# EasyEDA Pro project ProPrj_gas alarm_2025-01-07.epro

# Schematic Schematic1
Board Name: Board1; Create Date: 2024-12-28; Page Name: P1; Project Name: gas alarm; Schematic Name: Schematic1; Update Date: 2024-12-31; Company: EasyEDA.com; Page Size: A4; Version: V1.0
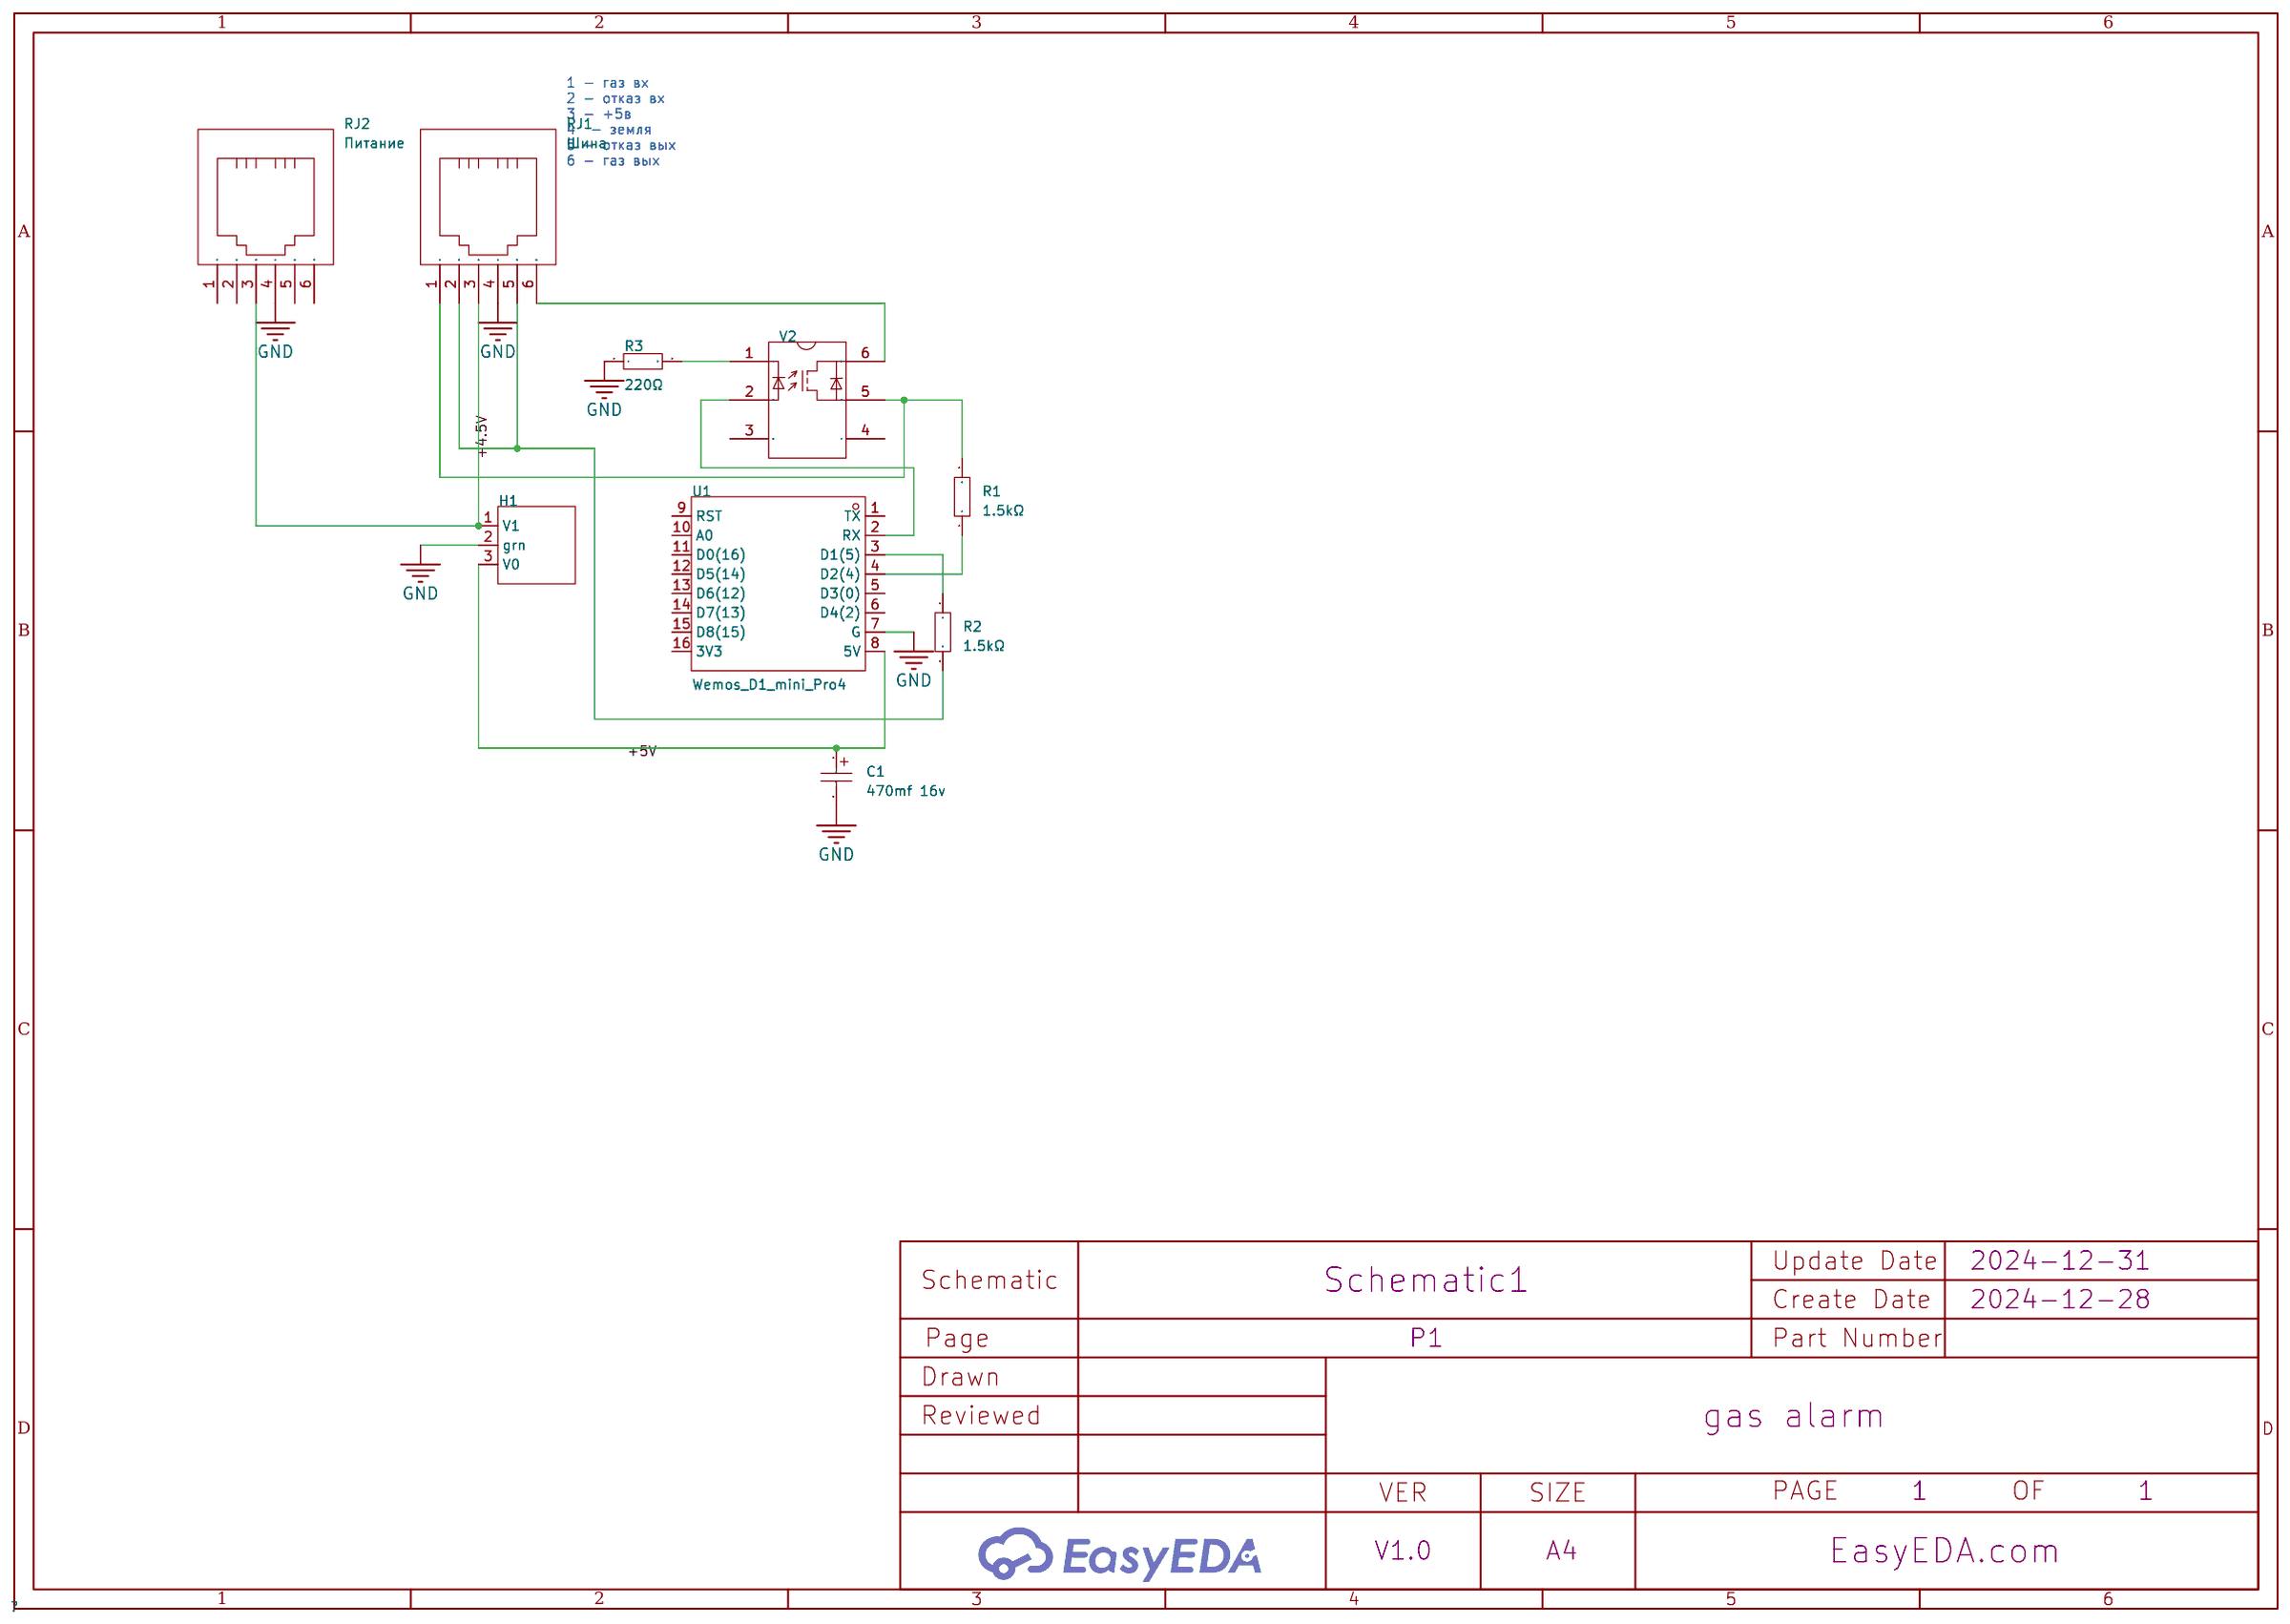
[diagram p0: schematic sheet]

## Parts
C1  470mf 16v  [LAMP-TH_BD5.8-P2.00_2181]
H1  -  [HW-626]
R1  1.5kΩ  [R_AXIAL-0.4]
R2  1.5kΩ  [R_AXIAL-0.4]
R3  220Ω  [R_AXIAL-0.4]
RJ1  Шина  [RJ45-TH_KINGHELM_KH-9801-6P6C]
RJ2  Питание  [RJ45-TH_KINGHELM_KH-9801-6P6C]
U1  Wemos_D1_mini_Pro4  [DIP-16_WEMOS_D1_MINI_PRO4]
V2  -  [DIP6]

## Library data of the parts
C1 = C_Ele_SMD_3x5.4mm: Supplier Footprint: SMD,3x5.4mm
H1 = HW-6261: Supplier Footprint: Through
R1-R3 = Res_AXIAL-1/4W: Supplier Footprint: Through
RJ1 RJ2 = KH-9801-6P6C: Connector Type:- Number of Ports:1 Mounting Style:Right-Angle Shielding:Unshielded LED:不带LED Ratings:- Operating Temperature Range:0℃~+70℃ Operating Temperature Range:0℃~+70℃; LCSC Part Name: 弯插 不带LED; Supplier Part: C2683355; Manufacturer: kinghelm(金航标); Manufacturer Part: RJ-12 (RJ-25) 6P6C; Supplier Footprint: 插件; JLCPCB Part Class: Extended Part; Datasheet: https://atta.szlcsc.com/upload/public/pdf/source/20210106/C2683355_D23B52E5E92918463C1B01F1D9BAADBB.pdf; Supplier: LCSC; Number of Ports: 1; Mounting Style: Right-Angle; Shielding: Unshielded; LED: 不带LED; Operating Temperature Range: 0℃~+70℃
U1 = Wemos_D1_mini_Pro4: Supplier Part: C2837266; Supplier Footprint: DIP-16; JLCPCB Part Class: Extended Part; Supplier: LCSC
V2 = KP293KП

## Nets
+4.5V: H1.1(V1) RJ1.3 RJ2.3
+5V: C1.1 H1.3(V0) U1.8(5V)
GND: C1.2 H1.2(grn) R3.1 RJ1.4 RJ2.4 U1.7(G)
$1N1308: R3.2 V2.1
$1N1397: R2.2 RJ1.2 RJ1.5
$1N1426: RJ1.6 V2.6
$1N2007: R1.2 RJ1.1 V2.5
$1N2050: U1.2(RX) V2.2
$1N3633: R2.1 U1.3(D1(5))
$1N3641: R1.1 U1.4(D2(4))

Not connected (* = marked no-connect by the designer): RJ2 1 2 5 6; U1 1(TX) 5(D3(0)) 6(D4(2)) 9(RST) 10(A0) 11(D0(16)) 12(D5(14)) 13(D6(12)) 14(D7(13)) 15(D8(15)) 16(3V3); V2 3 4

## Notes on the sheet
- 1 - газ вх
  2 - отказ вх
  3 - +5в
  4  - земля
  5 - отказ вых
  6 - газ вых

# Board PCB1
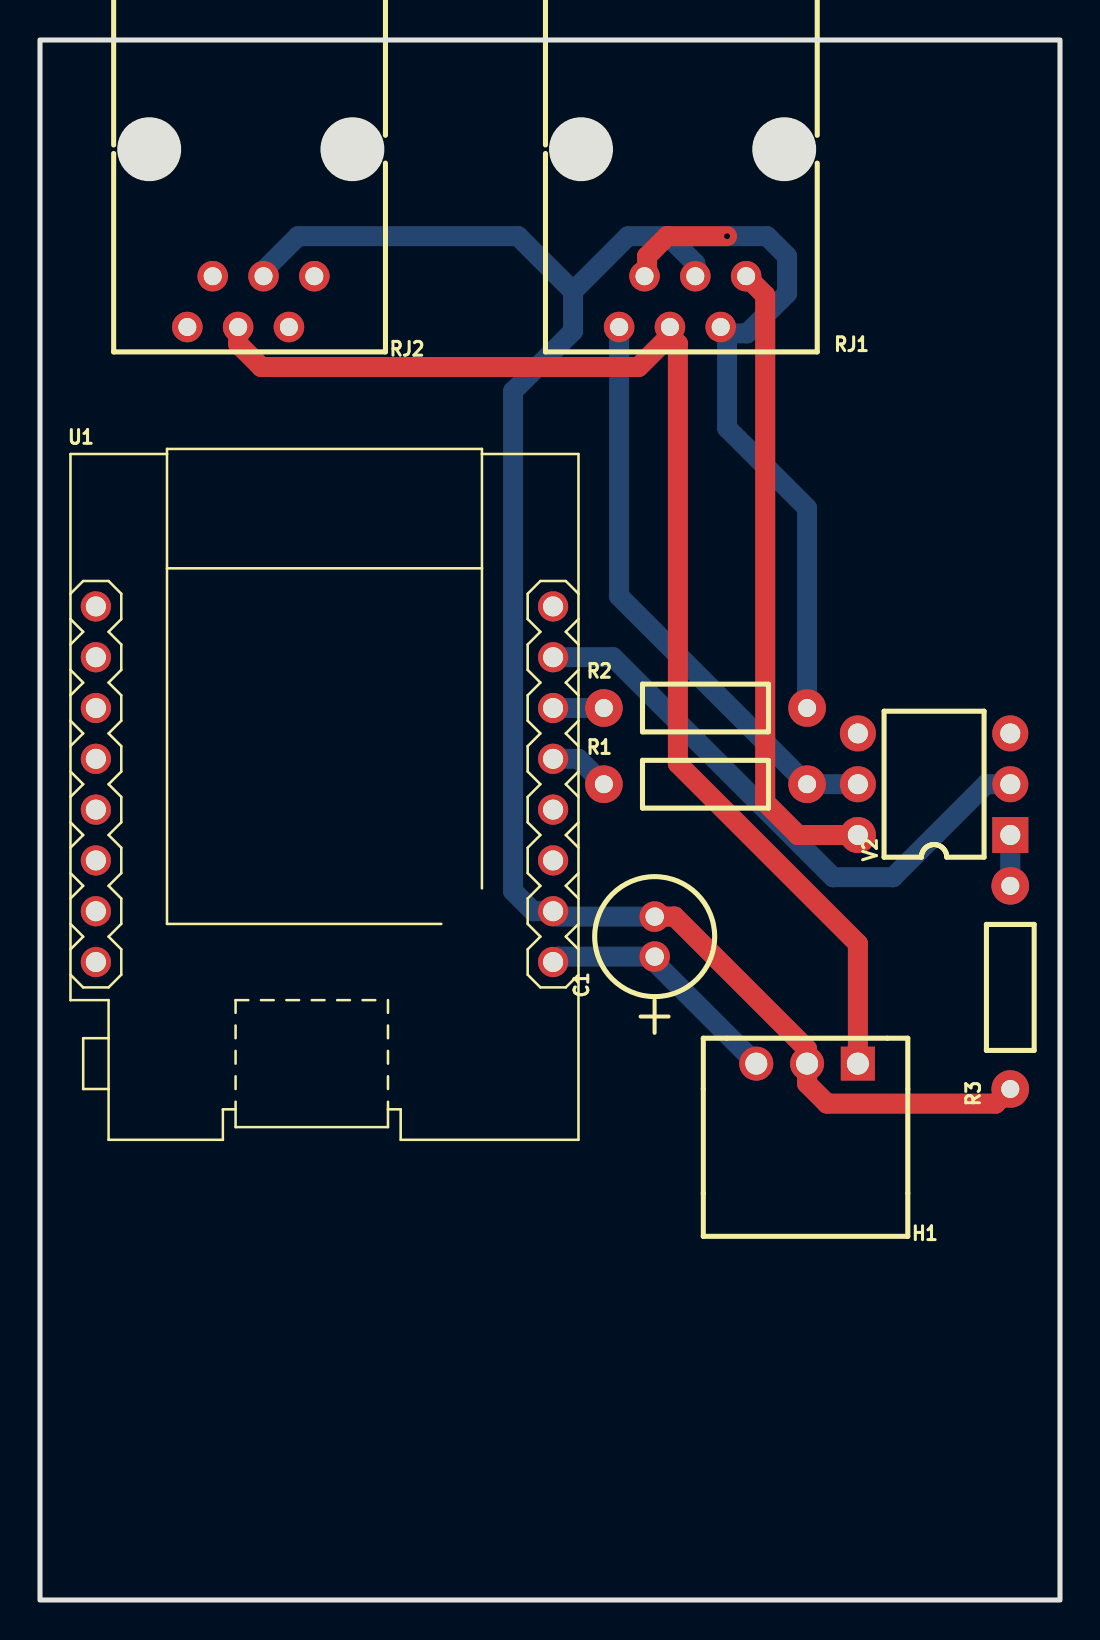
[diagram p1: board, top side]
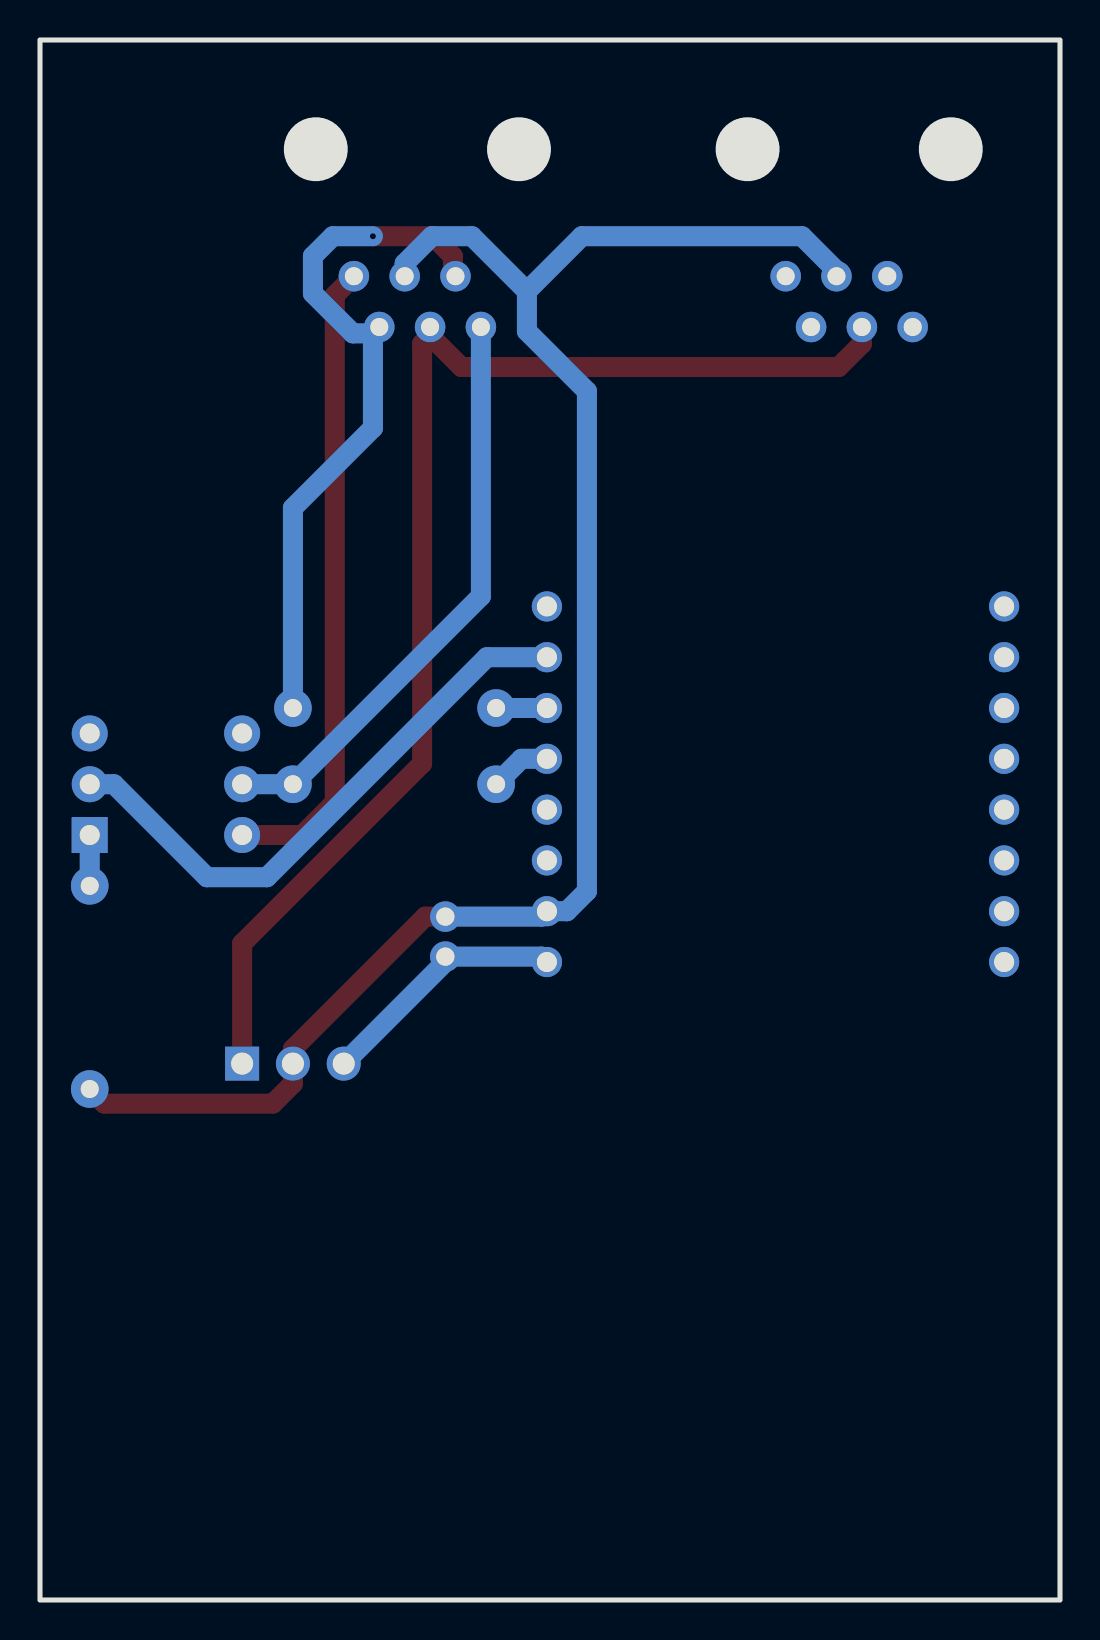
[diagram p2: board, bottom side, seen from below]

Outline 51 x 78 mm; copper layers: Top Layer, Bottom Layer. Coordinates in mm from the lower left corner of the outline.
Outline path: rectangle 0,78 51,0
Stack: Top Layer 0.035mm / Dielectric1 1.51mm FR4 er 4.5 / Bottom Layer 0.035mm

## Design rules (mm)
template: Custom Config
spacing copperThickness1oz: track to track 0.102, other pairs 0.152 to 0.3
spacing Mikle (default): track to track 0.635, other pairs 0.152 to 0.635
track width copperThickness1oz: min 0.127, default 0.254, max 2.54
track width Mikle (default): min 0.203, default 1, max 2.54
differential pair differentialPair (default): width min 0.127, default 0.254, max 2.54; gap min 0.152, default 0.152
via viaSize (default): diameter min 0.5, default 0.635, max 10; hole min 0.3, default 0.305, max 6.299

## Placement (name value [footprint] x y rotation side)
C1  470mf 16v  [LAMP-TH_BD5.8-P2.00_2181]  30.73 33.17 90 top
H1  -  [HW-626]  38.35 26.82 180 top
R1  1.5kΩ  [R_AXIAL-0.4]  33.27 40.79 0 top
R2  1.5kΩ  [R_AXIAL-0.4]  33.27 44.6 0 top
R3  220Ω  [R_AXIAL-0.4]  48.51 30.63 90 top
RJ1  Шина  [RJ45-TH_KINGHELM_KH-9801-6P6C]  32 64.92 180 top
RJ2  Питание  [RJ45-TH_KINGHELM_KH-9801-6P6C]  10.41 64.92 180 top
U1  Wemos_D1_mini_Pro4  [DIP-16_WEMOS_D1_MINI_PRO4]  14.22 40.79 0 top
V2  -  [DIP6]  44.7 40.79 90 top

## Footprints (pads in the part's own frame, mm; a bottom-side part is the same pattern mirrored in y, then rotated)
DIP6
  rect 1.8x1.8 hole 1: 1(-2.54,-3.81)
  round 1.8 hole 1: 2(0,-3.81) 3(2.54,-3.81) 4(2.54,3.81) 5(0,3.81) 6(-2.54,3.81)
DIP-16_WEMOS_D1_MINI_PRO4
  round 1.508 hole 1x1: 1(11.43,8.89) 2(11.43,6.35) 3(11.43,3.81) 4(11.43,1.27) 5(11.43,-1.27) 6(11.43,-3.81) 7(11.43,-6.35) 8(11.43,-8.89) 9(-11.43,8.89) 10(-11.43,6.35) 11(-11.43,3.81) 12(-11.43,1.27) 13(-11.43,-1.27) 14(-11.43,-3.81) 15(-11.43,-6.35) 16(-11.43,-8.89)
HW-626
  rect 1.7x1.7 hole 1.1: 1(-2.54,0)
  round 1.7 hole 1.1: 2(0,0) 3(2.54,0)
LAMP-TH_BD5.8-P2.00_2181
  round 1.524 hole 0.914: 1(-1,0) 2(1,0)
R_AXIAL-0.4
  round 1.879 hole 0.899: 1(-5.08,0) 2(5.08,0)
RJ45-TH_KINGHELM_KH-9801-6P6C
  round 1.524 hole 0.9: 1(3.048,1.27) 2(1.778,-1.27) 3(0.508,1.27) 4(-0.762,-1.27) 5(-2.032,1.27) 6(-3.302,-1.27)

## Nets
As in the schematic.

Pads without a net: RJ2 1 2 5 6; U1 1 5 6 9 10 11 12 13 14 15 16; V2 3 4

## Via types
v1: diameter 0.635, hole 0.305, Top Layer to Bottom Layer, 1 via

## Routing (per net, layer and track width the routed paths; a pad name or vN(x,y) marks a point on that pad's centre or on a via; arc(x,y) is an arc through that point)
+4.5V: length 64.3
  Top Layer w1: RJ2.3 9.91,62.81 11.06,61.65 29.93,61.65 31.5,63.22 ; 31.5,63.22 31.89,62.82 31.89,41.82 40.89,32.82 H1.1 ; 31.5,63.22 RJ1.3
+5V: length 12.6
  Bottom Layer w1: H1.3 30.73,31.9 C1.1 25.92,32.17 U1.8
GND: length 87.9
  Top Layer w1: C1.2 31.73,34.17 38.35,27.55 H1.2 38.35,25.82 39.35,24.82 47.78,24.82 R3.1
  Bottom Layer w1: RJ2.4 11.18,66.46 12.9,68.19 23.9,68.19 26.65,65.44 ; 26.65,65.44 29.4,68.19 31.4,68.19 32.77,66.83 RJ1.4 ; 26.65,65.44 26.65,63.44 23.65,60.44 23.65,35.44 24.65,34.44 U1.7 25.92,34.17 C1.2
$1N1308: length 2.5
  Bottom Layer w1: R3.2 V2.1
$1N1397: length 35.4
  Top Layer w1: v1(34.35,68.19) 31.35,68.19 30.35,67.19 30.35,66.32 RJ1.2
  Bottom Layer w1: 34.35,63.33 35.35,63.33 37.35,65.33 37.35,67.19 36.35,68.19 v1(34.35,68.19) ; 34.35,63.33 34.35,58.6 38.35,54.6 R2.2 ; 34.35,63.33 RJ1.5
$1N1426: length 32
  Top Layer w1: V2.6 37.89,38.25 36.26,39.88 36.26,65.24 RJ1.6
$1N2007: length 29.3
  Bottom Layer w1: V2.5 R1.2 28.96,50.19 RJ1.1
$1N2050: length 29.3
  Bottom Layer w1: U1.2 28.65,47.14 39.65,36.14 42.65,36.14 47.3,40.79 V2.2
$1N3633: length 2.5
  Bottom Layer w1: R2.1 U1.3
$1N3641: length 3.1
  Bottom Layer w1: U1.4 26.92,42.06 R1.1

## Text on the board
Top Silkscreen Layer: +
